# EAGLE board e-book_schema (EAGLE 9.7.0)
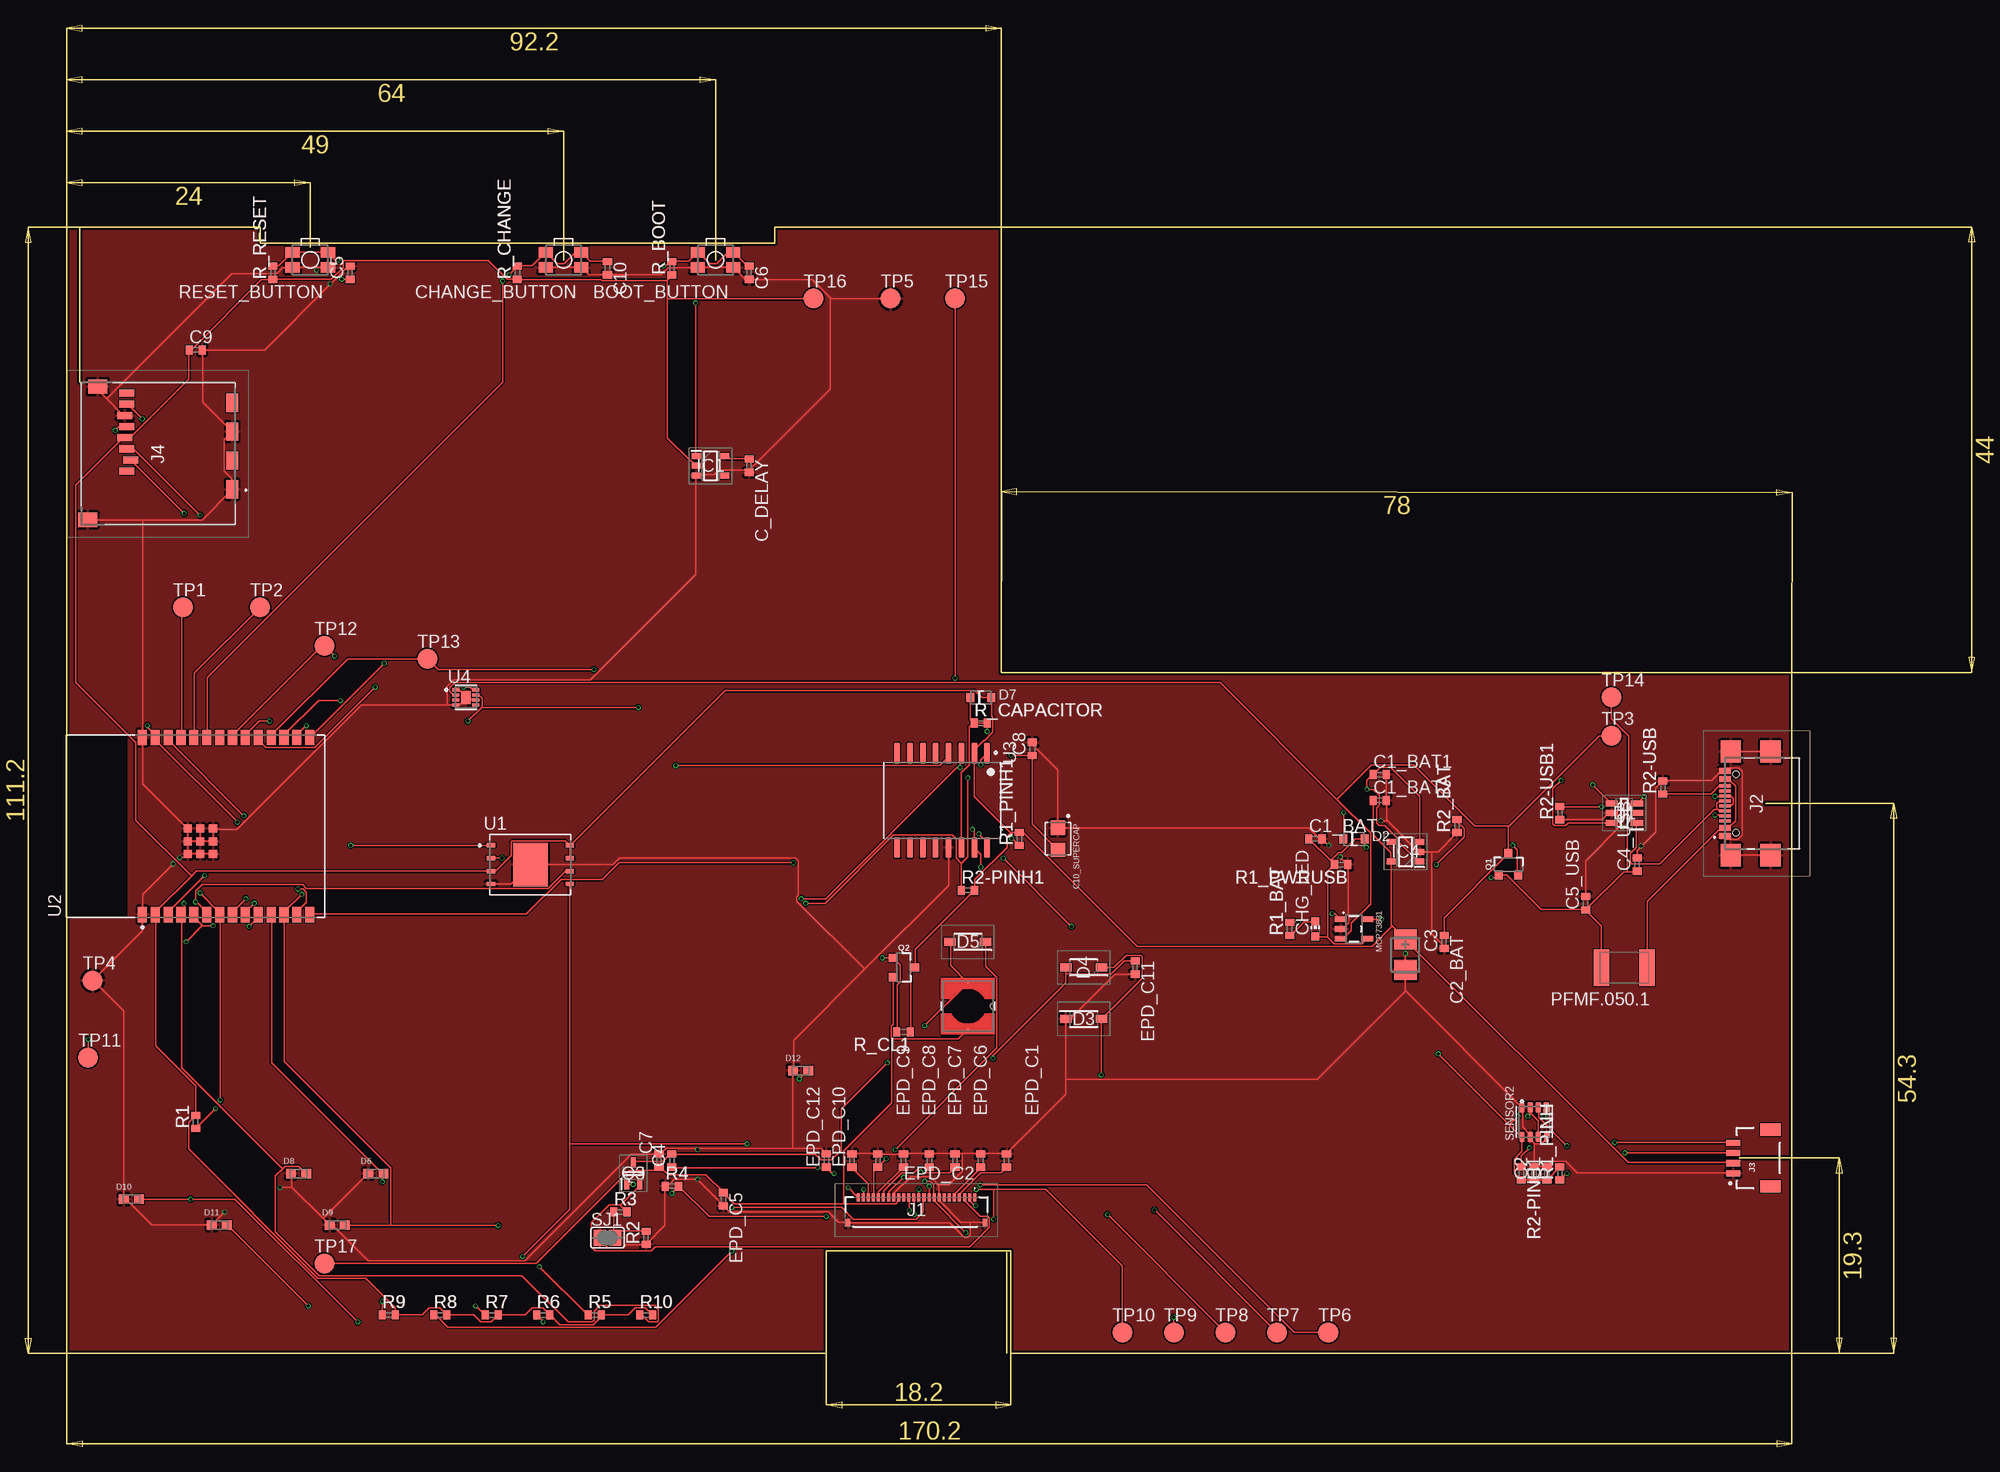
[diagram p1: board, top side]
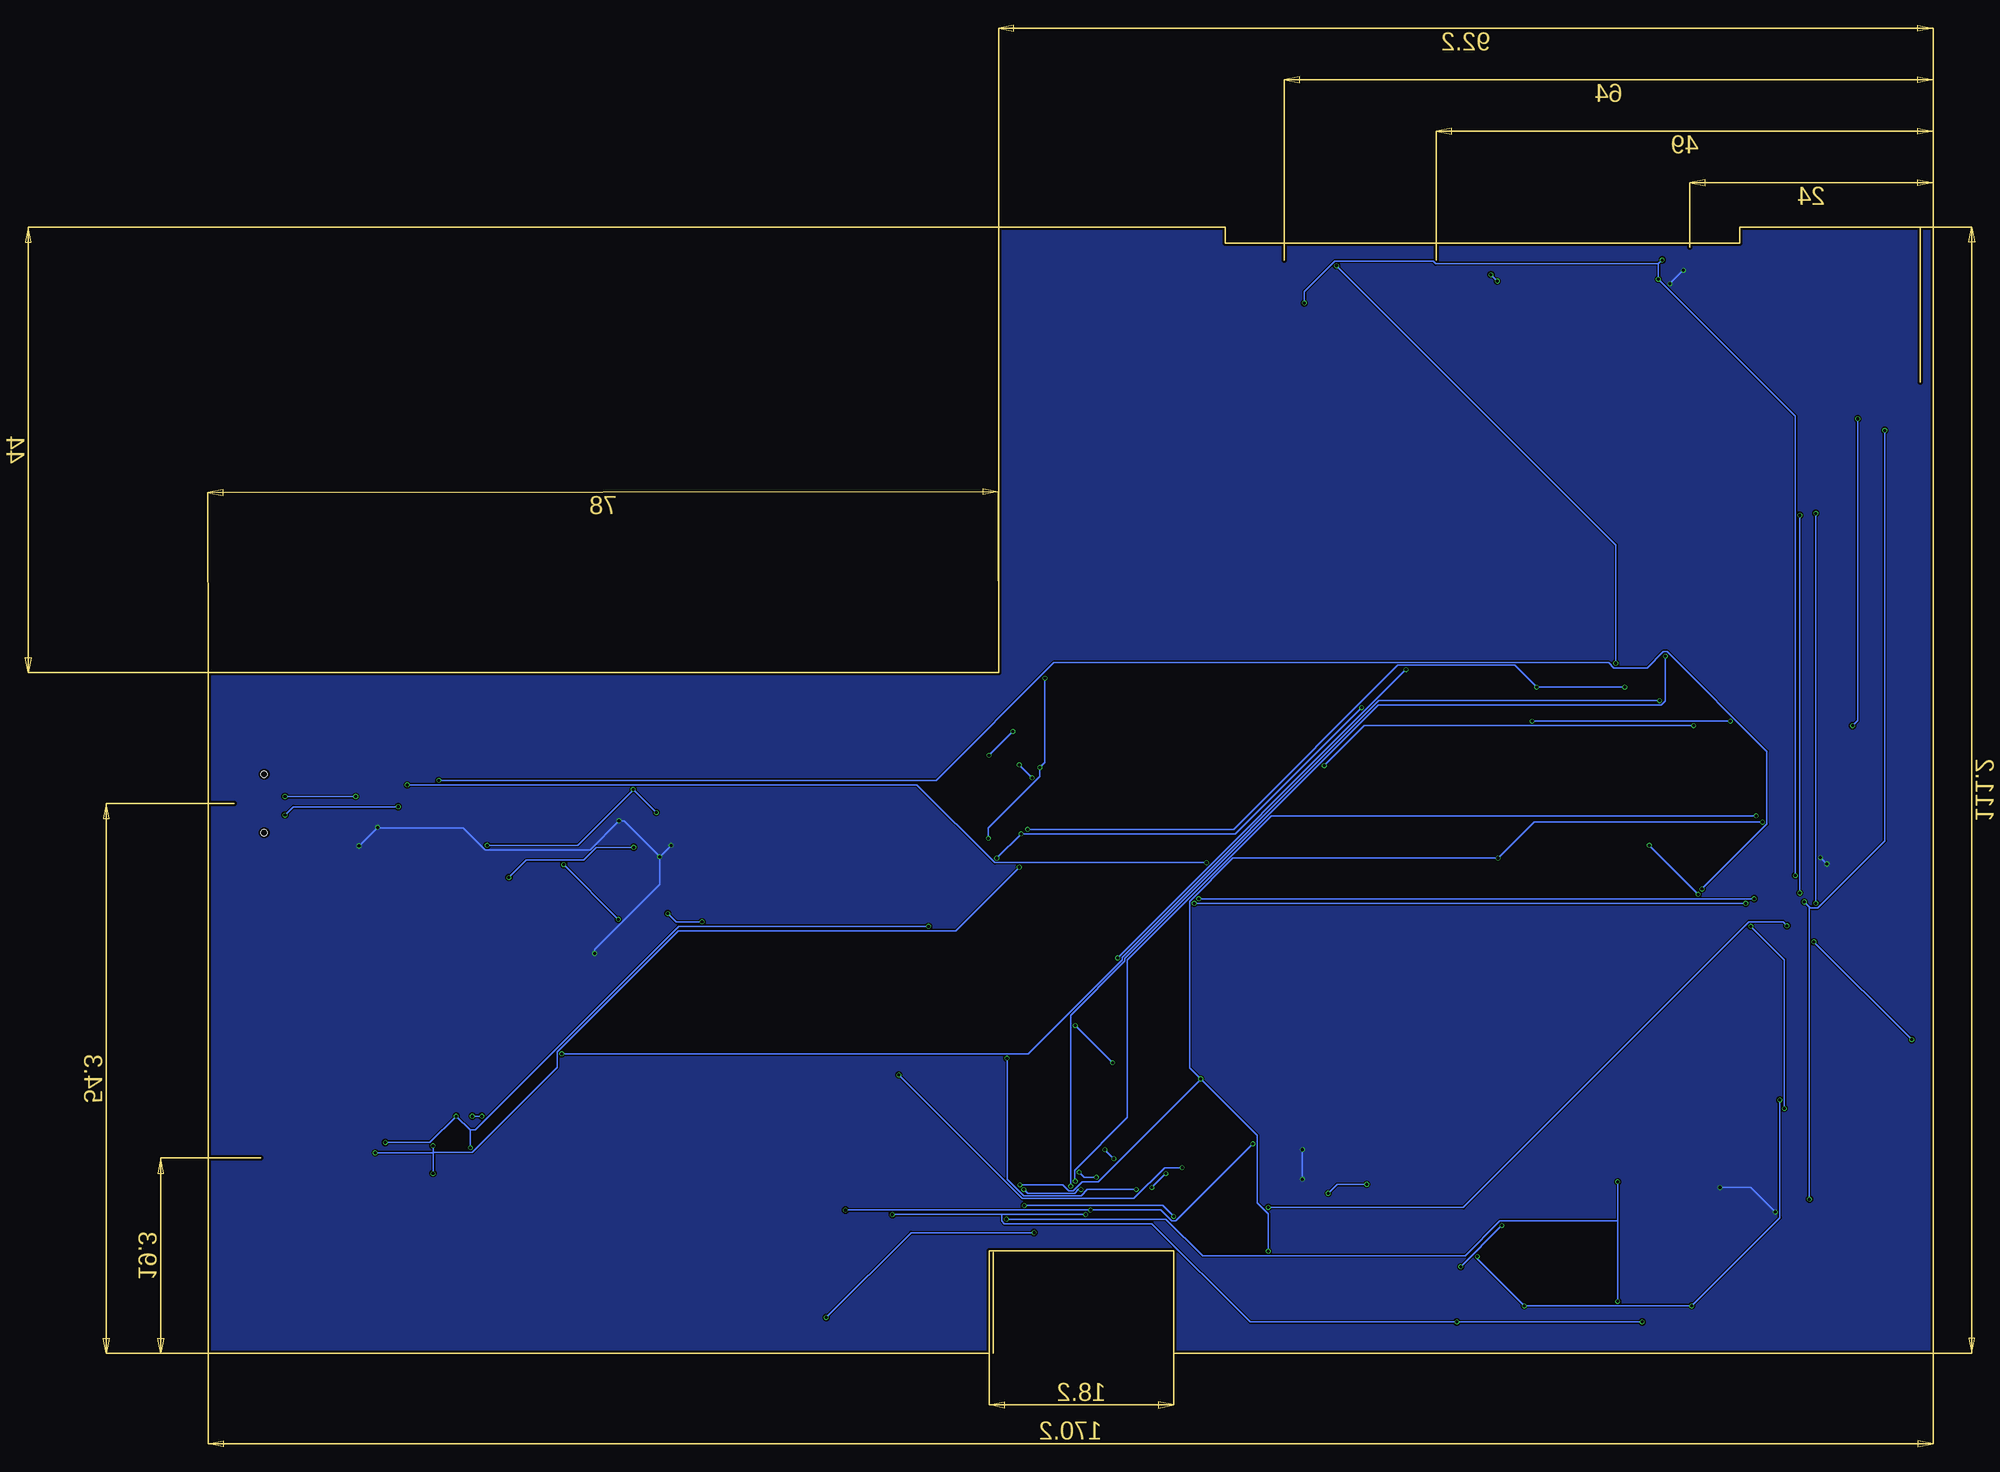
[diagram p2: board, bottom side, seen from below]

Size 170.2 x 111.2 mm. Coordinates in mm from the lower left corner, seen from the top.
Outline: 0,0 0,111.2 19.05,111.2 19.05,109.6 69.85,109.6 69.85,111.2 92.2,111.2 92.2,67.2 170.2,67.2 170.2,0 93.13,0 93.13,10.16 74.93,10.16 74.93,0 0,0
Copper layers (1*16): Top 0.035mm / dielectric 1.6mm / Bottom 0.035mm
Design rules "jlcpcb-2layers.edru": minimum track width 5mil, minimum drill 0.3mm, track to track 5mil, track to pad 5mil, pad to pad 5mil, via to via 5mil, smd to smd 5mil, copper to edge 0.2mm, drill to drill 6mil, minimum pad ring 10mil, minimum via ring 3mil, stop-mask expansion 4mil, vias tented up to drill 0mil, thermal gap 10mil

## Footprints (pad centres in the part's own frame; a part is rotated, then mirrored left to right if it is on the bottom)
MYBUTTON = smd 1.4 x 1.05: 1 1.75,0.75; 2 -1.75,0.75; 3 -1.75,-0.75; 4 1.75,-0.75
EAGLE-LTSPICE_C0402 = smd 0.7 x 0.9: 1 -0.65,0; 2 0.65,0
RCL_CT3528 = smd 2 x 2.2: + -1.5,0; - 1.5,0
CAPCP3225X100N = smd 1.4 x 1.4: 1 -1.1,0; 2 1.1,0
ADAFRUIT_CHIP-LED0603 = smd 0.8 x 0.8: A 0,-0.75; C 0,0.75
SOT95P280X145-6N = smd 1.2 x 0.6: 1 -1.25,0.95; 2 -1.25,0; 3 -1.25,-0.95; 4 1.25,-0.95; 5 1.25,0; 6 1.25,0.95
ESP32_WROVER_AVX---SD0805S020S1R0_AVX_SD0805S020S1R0_0 = smd 0.8 x 0.9: 1 -1.05,0; 2 1.05,0
SOD3716X135N = smd 1.15 x 0.8: 1 -1.75,0; 2 1.75,0
DIOC1608X36N = smd 0.97 x 0.94: 1 -0.75,0; 2 0.75,0
SOT95P280X125-5N = smd 0.9 x 0.6: 1 -1.4,0.95; 2 -1.4,0; 3 -1.4,-0.95; 4 1.4,-0.95; 5 1.4,0.95
SOT95P280X120-5N = smd 0.9 x 0.6: 1 -1.4,0.95; 2 -1.4,0; 3 -1.4,-0.95; 4 1.4,-0.95; 5 1.4,0.95
FH34SRJ24S05SH99 = smd 0.3 x 0.8: 1 5.75,1.45; 2 5.25,1.45; 3 4.75,1.45; 4 4.25,1.45; 5 3.75,1.45; 6 3.25,1.45; 7 2.75,1.45; 8 2.25,1.45; 9 1.75,1.45; 10 1.25,1.45; 11 0.75,1.45; 12 0.25,1.45; 13 -0.25,1.45; 14 -0.75,1.45; 15 -1.25,1.45; 16 -1.75,1.45; 17 -2.25,1.45; 18 -2.75,1.45; 19 -3.25,1.45; 20 -3.75,1.45; 21 -4.25,1.45; 22 -4.75,1.45; 23 -5.25,1.45; 24 -5.75,1.45 | smd 0.4 x 0.8: MP1 6.75,-1.05; MP2 -6.75,-1.05
SAMACSYS_PARTS_USB4110GFA = smd 0.3 x 1.15: A1 -3.35,3.678; A4 -2.55,3.678; A5 -1.25,3.678; A6 -0.25,3.678; A7 0.25,3.678; A8 1.25,3.678; A9 2.55,3.678; A12 3.35,3.678; B1 3.05,3.678; B4 2.25,3.678; B5 1.75,3.678; B6 0.75,3.678; B7 -0.75,3.678; B8 -1.75,3.678; B9 -2.25,3.678; B12 -3.05,3.678 | smd 2.18 x 2: MP1 -5.11,-0.827; MP2 5.11,-0.827; MP3 -5.11,3.103; MP4 5.11,3.103 | hole 0.65: -2.89,2.603; 2.89,2.603
JST04_1MM_RA = smd 0.6 x 1.35: 1 -1.5,0; 2 -0.5,0; 3 0.5,0; 4 1.5,0 | smd 1.2 x 2: NC1 2.8,-3.675; NC2 -2.8,-3.675
112ATAARR03ATTEND = smd 1.8 x 1.2: G1 10.6,10.4; G2 4.9,10.4; S1 7.75,10.4; S2 2.05,10.4 | smd 1.4 x 1.9: G3 13.6,-3.85; G4 0.45,-2.85 | smd 0.7 x 1.5: P1 8.8,0; P2 7.7,0.4; P3 6.6,0; P4 5.5,-0.2; P5 4.4,0; P6 3.3,-0.2; P7 2.2,0; P8 1.1,0
IND_4828-WE-TPC_WRE = smd 0.127 x 0.127: 1 -2.286,0; 2 2.286,0
ESP32_WROVER_SPARKFUN-IC-POWER_SOT23-5 = smd 0.55 x 1.2: 1 -0.95,-1.3; 2 0,-1.3; 3 0.95,-1.3; 4 0.95,1.3; 5 -0.95,1.3
ESP32C6_VARISTOR_CT/CN1812 = smd 1.5 x 3.6: 1 -2.25,0; 2 2.25,0
ESP32_WROVER_SPARKFUN-DISCRETESEMI_SOT23-3 = smd 0.8 x 0.9: 1 -0.95,-1; 2 0.95,-1; 3 0,1.1
SOT65P210X110-3N = smd 1.05 x 0.5: 1 -1.05,0.65; 2 -1.05,-0.65; 3 1.05,0
ESP32_WROVER_EAGLE-LTSPICE_R0402 = smd 0.7 x 0.9: 1 -0.65,0; 2 0.65,0
ESP32_WROVER_BME680_PSON80P300X300X100-8N = smd 1.016 x 0.5: 1 1.458,1.2; 2 1.458,0.4; 3 1.458,-0.4; 4 1.458,-1.2; 5 -1.458,-1.22; 6 -1.458,-0.4; 7 -1.458,0.4; 8 -1.458,1.2
SJ = smd 1.168 x 1.6: 1 -0.762,0; 2 0.762,0
TP20R = smd 2 x 2: TP 0,0
SON127P600X800X80-9N = smd 0.94 x 0.44: 1 -3.895,1.905; 2 -3.895,0.635; 3 -3.895,-0.635; 4 -3.895,-1.905; 5 3.895,-1.905; 6 3.895,-0.635; 7 3.895,0.635; 8 3.895,1.905 | smd 3.4 x 4.3: 9 0,0
XCVR_ESP32-C6-WROOM-1-N8 = smd 1.5 x 0.9: 1 -8.75,5.26; 2 -8.75,3.99; 3 -8.75,2.72; 4 -8.75,1.45; 5 -8.75,0.18; 6 -8.75,-1.09; 7 -8.75,-2.36; 8 -8.75,-3.63; 9 -8.75,-4.9; 10 -8.75,-6.17; 11 -8.75,-7.44; 12 -8.75,-8.71; 13 -8.75,-9.98; 14 -8.75,-11.25; 15 8.75,-11.25; 16 8.75,-9.98; 17 8.75,-8.71; 18 8.75,-7.44; 19 8.75,-6.17; 20 8.75,-4.9; 21 8.75,-3.63; 22 8.75,-2.36; 23 8.75,-1.09; 24 8.75,0.18; 25 8.75,1.45; 26 8.75,2.72; 27 8.75,3.99; 28 8.75,5.26 | smd 0.8 x 0.8: 29_1 -2.755,0.79; 29_2 -1.505,0.79; 29_3 -0.255,0.79; 29_4 -2.755,-0.46; 29_5 -1.505,-0.46; 29_6 -0.255,-0.46; 29_7 -2.755,-1.71; 29_8 -1.505,-1.71; 29_9 -0.255,-1.71
SOIC127P1032X265-16N = smd 2.05 x 0.59: 1 -4.655,4.445; 2 -4.655,3.175; 3 -4.655,1.905; 4 -4.655,0.635; 5 -4.655,-0.635; 6 -4.655,-1.905; 7 -4.655,-3.175; 8 -4.655,-4.445; 9 4.655,-4.445; 10 4.655,-3.175; 11 4.655,-1.905; 12 4.655,-0.635; 13 4.655,0.635; 14 4.655,1.905; 15 4.655,3.175; 16 4.655,4.445
SON50P200X200X80-9N = smd 0.76 x 0.27: 1 -0.985,0.75; 2 -0.985,0.25; 3 -0.985,-0.25; 4 -0.985,-0.75; 5 0.985,-0.75; 6 0.985,-0.25; 7 0.985,0.25; 8 0.985,0.75 | smd 0.9 x 1.3: 9 0,0

## Placement (x,y rotation side)
BOOT_BUTTON  BUTTON_CUSYOMV1  [MYBUTTON]  64,107.95 180 top
C1  100nF  [EAGLE-LTSPICE_C0402]  146.05,17.78 90 top
C1_BAT  4.7uF  [EAGLE-LTSPICE_C0402]  123.19,50.8 0 top
C1_BAT1  4.7uF  [EAGLE-LTSPICE_C0402]  129.54,57.15 0 top
C1_BAT2  4.7uf  [EAGLE-LTSPICE_C0402]  129.54,54.61 0 top
C2  100nF  [EAGLE-LTSPICE_C0402]  144.78,17.78 90 top
C2_BAT  4.7uF  [EAGLE-LTSPICE_C0402]  135.89,40.64 270 top
C3  100uF TANT  [RCL_CT3528]  132.08,39.37 270 top
C4  4.7uF/25V  [EAGLE-LTSPICE_C0402]  59.69,19.05 90 top
C4_USB  100nF  [EAGLE-LTSPICE_C0402]  154.94,48.26 90 top
C5  1uF  [EAGLE-LTSPICE_C0402]  27.94,106.68 90 top
C5_USB  4.7uF  [EAGLE-LTSPICE_C0402]  149.86,44.45 90 top
C6  100nF  [EAGLE-LTSPICE_C0402]  67.31,106.68 270 top
C7  10uF  [EAGLE-LTSPICE_C0402]  58.42,19.05 90 top
C8  100nF  [EAGLE-LTSPICE_C0402]  95.25,59.69 90 top
C9  100nF  [EAGLE-LTSPICE_C0402]  12.7,99.06 0 top
C10  100nF  [EAGLE-LTSPICE_C0402]  53.34,107.13 270 top
C10_SUPERCAP  CPH3225A  [CAPCP3225X100N]  97.79,50.8 270 top
C_DELAY  100nF  [EAGLE-LTSPICE_C0402]  67.31,87.63 270 top
CHANGE_BUTTON  BUTTON_CUSYOMV1  [MYBUTTON]  49,107.95 180 top
CHG_LED  [ADAFRUIT_CHIP-LED0603]  123.19,41.91 0 top
D1  USBLC6-2SC6Y  [SOT95P280X145-6N]  153.67,53.34 180 top
D2  ESP32_WROVER_AVX---SD0805S020S1R0_AVX_SD0805S020S1R0_0_0AVX_SD0805S020S1R0_0_0  [ESP32_WROVER_AVX---SD0805S020S1R0_AVX_SD0805S020S1R0_0]  127,50.8 0 top
D3  MBR0530  [SOD3716X135N]  100.33,33.02 0 top
D4  MBR0530  [SOD3716X135N]  100.33,38.1 180 top
D5  MBR0530  [SOD3716X135N]  88.9,40.64 180 top
D6  PGB1010603MR  [DIOC1608X36N]  30.48,17.78 0 top
D7  ESP32_WROVER_AVX---SD0805S020S1R0_AVX_SD0805S020S1R0_0_0AVX_SD0805S020S1R0_0_0  [ESP32_WROVER_AVX---SD0805S020S1R0_AVX_SD0805S020S1R0_0]  90.17,64.77 0 top
D8  PGB1010603MR  [DIOC1608X36N]  22.86,17.78 0 top
D9  PGB1010603MR  [DIOC1608X36N]  26.67,12.7 0 top
D10  PGB1010603MR  [DIOC1608X36N]  6.35,15.24 0 top
D11  PGB1010603MR  [DIOC1608X36N]  15.03,12.7 0 top
D12  PGB1010603MR  [DIOC1608X36N]  72.39,27.94 0 top
EPD_C1  1uF/50V  [EAGLE-LTSPICE_C0402]  92.71,19.05 90 top
EPD_C2  1uF/50V  [EAGLE-LTSPICE_C0402]  90.17,19.05 90 top
EPD_C5  0.1uF/50V  [EAGLE-LTSPICE_C0402]  64.77,15.24 270 top
EPD_C6  1uF/50V  [EAGLE-LTSPICE_C0402]  87.63,19.05 90 top
EPD_C7  1uF/50V  [EAGLE-LTSPICE_C0402]  85.09,19.05 90 top
EPD_C8  1uF/50V  [EAGLE-LTSPICE_C0402]  82.55,19.05 90 top
EPD_C9  1uF/50V  [EAGLE-LTSPICE_C0402]  80.01,19.05 90 top
EPD_C10  1uF/50V  [EAGLE-LTSPICE_C0402]  77.47,19.05 90 top
EPD_C11  1uF/50V  [EAGLE-LTSPICE_C0402]  105.41,38.1 270 top
EPD_C12  1uF/50V  [EAGLE-LTSPICE_C0402]  74.93,19.05 90 top
IC1  BD5229G-TR  [SOT95P280X125-5N]  63.5,87.63 0 top
IC4  XC6220A331MR-G  [SOT95P280X120-5N]  132.08,49.53 180 top
J1  FH34SRJ-24S-0.5SH_99_  [FH34SRJ24S05SH99]  83.82,13.97 0 top
J2  SAMACSYS_PARTS_USB4110-GF-A  [SAMACSYS_PARTS_USB4110GFA]  167.28,54.3 90 top
J3  QWIIC_RIGHT_ANGLE  [JST04_1MM_RA]  164.43,19.3 90 top
J4  112A-TAAR-R03_ATTEND  [112ATAARR03ATTEND]  5.89,95.9 270 top
L1  68uH  [IND_4828-WE-TPC_WRE]  88.9,34.29 270 top
MCP73831  ESP32_WROVER_SPARKFUN-IC-POWER_MCP73831  [ESP32_WROVER_SPARKFUN-IC-POWER_SOT23-5]  127,41.91 270 top
PFMF.050.1  ESP32C6_VARISTORCN1812  [ESP32C6_VARISTOR_CT/CN1812]  153.67,38.1 180 top
Q1  20V/4.2A/52mΩ/1.4W  [ESP32_WROVER_SPARKFUN-DISCRETESEMI_SOT23-3]  142.24,48.26 0 top
Q2  20V/4.2A/52mΩ/1.4W  [ESP32_WROVER_SPARKFUN-DISCRETESEMI_SOT23-3]  82.55,38.1 270 top
Q3  SI1308EDL-T1-GE3  [SOT65P210X110-3N]  55.88,17.78 90 top
R1  10k  [ESP32_WROVER_EAGLE-LTSPICE_R0402]  12.7,22.86 90 top
R1_BAT  200  [ESP32_WROVER_EAGLE-LTSPICE_R0402]  120.65,41.91 90 top
R1_PINH  10K  [ESP32_WROVER_EAGLE-LTSPICE_R0402]  147.32,17.78 90 top
R1_PINH1  10K  [ESP32_WROVER_EAGLE-LTSPICE_R0402]  93.98,50.8 90 top
R1_PWRUSB  100k  [ESP32_WROVER_EAGLE-LTSPICE_R0402]  125.73,48.26 180 top
R2  2.2  [ESP32_WROVER_EAGLE-LTSPICE_R0402]  57.15,11.43 90 top
R2-PINH  10K  [ESP32_WROVER_EAGLE-LTSPICE_R0402]  143.51,17.78 270 top
R2-PINH1  10K  [ESP32_WROVER_EAGLE-LTSPICE_R0402]  88.9,45.72 0 top
R2-USB  5K1  [ESP32_WROVER_EAGLE-LTSPICE_R0402]  157.48,55.88 90 top
R2-USB1  5K1  [ESP32_WROVER_EAGLE-LTSPICE_R0402]  147.32,53.34 90 top
R2_BAT  2K  [ESP32_WROVER_EAGLE-LTSPICE_R0402]  137.16,52.07 90 top
R3  0.47  [ESP32_WROVER_EAGLE-LTSPICE_R0402]  54.61,13.97 0 top
R4  10k  [ESP32_WROVER_EAGLE-LTSPICE_R0402]  59.69,16.51 0 top
R5  10K  [ESP32_WROVER_EAGLE-LTSPICE_R0402]  52.07,3.81 0 top
R6  10K  [ESP32_WROVER_EAGLE-LTSPICE_R0402]  46.99,3.81 0 top
R7  10K  [ESP32_WROVER_EAGLE-LTSPICE_R0402]  41.91,3.81 0 top
R8  10K  [ESP32_WROVER_EAGLE-LTSPICE_R0402]  36.83,3.81 0 top
R9  10K  [ESP32_WROVER_EAGLE-LTSPICE_R0402]  31.75,3.81 0 top
R10  10K  [ESP32_WROVER_EAGLE-LTSPICE_R0402]  57.15,3.81 0 top
R_BOOT  10K  [ESP32_WROVER_EAGLE-LTSPICE_R0402]  59.69,107.13 90 top
R_CAPACITOR  15  [ESP32_WROVER_EAGLE-LTSPICE_R0402]  90.17,62.23 0 top
R_CHANGE  10K  [ESP32_WROVER_EAGLE-LTSPICE_R0402]  44.45,106.68 90 top
R_CL1  10k  [ESP32_WROVER_EAGLE-LTSPICE_R0402]  82.55,31.75 180 top
R_RESET  10K  [ESP32_WROVER_EAGLE-LTSPICE_R0402]  20.32,106.68 90 top
RESET_BUTTON  BUTTON_CUSYOMV1  [MYBUTTON]  24,107.95 180 top
SENSOR2  ESP32_WROVER_BME680_BME680  [ESP32_WROVER_BME680_PSON80P300X300X100-8N]  144.78,22.86 90 top
SJ1  [SJ]  53.34,11.43 0 top
TP1  TPTP20R  [TP20R]  11.43,73.66 0 top
TP2  TPTP20R  [TP20R]  19.05,73.66 0 top
TP3  TPTP20R  [TP20R]  152.4,60.96 0 top
TP4  TPTP20R  [TP20R]  2.54,36.83 0 top
TP5  TPTP20R  [TP20R]  81.28,104.14 0 top
TP6  TPTP20R  [TP20R]  124.46,2.09 0 top
TP7  TPTP20R  [TP20R]  119.38,2.09 0 top
TP8  TPTP20R  [TP20R]  114.3,2.09 0 top
TP9  TPTP20R  [TP20R]  109.22,2.09 0 top
TP10  TPTP20R  [TP20R]  104.14,2.09 0 top
TP11  TPTP20R  [TP20R]  2.09,29.21 0 top
TP12  TPTP20R  [TP20R]  25.4,69.85 0 top
TP13  TPTP20R  [TP20R]  35.56,68.58 0 top
TP14  TPTP20R  [TP20R]  152.4,64.77 0 top
TP15  TPTP20R  [TP20R]  87.63,104.14 0 top
TP16  TPTP20R  [TP20R]  73.66,104.14 0 top
TP17  TPTP20R  [TP20R]  25.4,8.89 0 top
U1  W25Q512JVEIQ  [SON127P600X800X80-9N]  45.72,48.26 0 top
U2  ESP32-C6-WROOM-1-N8  [XCVR_ESP32-C6-WROOM-1-N8]  12.7,52.07 90 top
U3  DS3231SN#  [SOIC127P1032X265-16N]  86.36,54.61 270 top
U4  MAX17048G+T10  [SON50P200X200X80-9N]  39.37,64.77 0 top

## Tracks (layer width: path | path; a pad name or v marks a point on that pad's centre or on a via)
3V3
  Top 0.127: R_CL1.1 83.25,31.75 83.25,37.72 83.63,38.1 Q2.3 83.69,38.1 83.69,39.88 89.53,45.72 R2-PINH1.2 89.6,45.72 89.6,46.8 92.77,49.97 92.77,51.05 93.12,51.4 | 93.12,51.4 93.15,51.44 93.98,51.44 | 93.12,51.4 89.53,54.99 U3.2 89.53,59.56 90.49,60.52 90.55,60.52 91.38,61.34 91.38,62.8 91.25,62.93 91.25,64.77 D7.2 90.3,64.77 89.6,65.47 64.96,65.47 49.66,50.16 U1.8 49.59,50.16 | C1_BAT2.1 128.91,54.61 128.91,51.18 130.62,49.47 130.62,48.64 IC4.5 130.68,42.29 130.78,42.2 | J3.2 164.4,18.86 154.05,18.86 132.08,40.83 C3.+ 132.08,40.89 130.78,42.2 | 93.98,51.44 94.36,51.44 105.6,40.2 128.78,40.2 130.78,42.2 | 93.98,51.44 R1_PINH1.2 | 59.21,105.95 59.69,106.43 R_BOOT.1 | 59.21,105.95 59.18,105.92 52.77,105.92 52.7,105.98 44.45,105.98 R_CHANGE.1 44.45,106.05 43.43,106.05 41.59,107.89 27.37,107.89 27.24,107.76 27.24,107.19 26.1,106.05 20.32,106.05 R_RESET.1 20.32,105.98 19.18,105.98 12.26,99.06 C9.1 12,99.06 12,96.2 6.22,90.42 5.71,90.42 J4.P4 5.65,90.36 5.52,90.36 0.89,85.72 0.89,66.23 6.79,60.33 6.79,52.64 12.29,47.15 | 59.24,104.14 59.24,105.92 59.21,105.95 | 59.24,104.14 59.24,90.36 61.53,88.08 61.59,88.08 62.04,87.63 IC1.2 | 59.24,104.14 TP16.TP | R10.2 57.78,3.81 57.09,4.51 56.07,4.51 55.37,3.81 R5.2 52.7,3.81 52.7,3.62 51.94,2.86 48.64,2.86 47.69,3.81 R6.2 47.62,3.81 46.93,4.51 45.91,4.51 45.21,3.81 R7.2 42.55,3.81 41.85,3.11 40.83,3.11 40.13,3.81 R8.2 37.47,3.81 36.77,4.51 35.75,4.51 35.05,3.81 R9.2 32.38,3.81 32.38,4.51 29.46,7.43 24.77,7.43 12,20.19 12,22.8 12.7,23.5 R1.2 12.7,26.42 8.76,30.35 8.76,43.31 U2.2 8.76,43.37 8.76,43.62 12.29,47.15
  Top 0.127: 49.59,50.16 49.15,50.61 43.94,50.61 43.81,50.48 43.81,49.15 42.29,47.62 U1.3 12.76,47.62 12.29,47.15 | 49.59,50.16 49.59,48.9 U1.7
32KHZ  (via drill 0.3)
  Top 0.127: 88.27,48.39 88.27,45.72 R2-PINH1.1 | 88.27,48.39 88.9,49.02 v88.9,56.83 | v90.17,58.1 90.17,58.61 90.81,59.24 U3.1 | v18.48,44.45 17.65,43.62 17.65,43.37 U2.9 | v72.9,44.45 74.8,44.45 81.53,51.18 87.38,51.18 87.76,50.8 87.76,48.9 88.27,48.39
  Bottom 0.127: v90.17,58.1 v88.9,56.83 | v72.9,44.45 v18.48,44.45
DN
  Top 0.127: 162.85,53.75 162.81,53.78 162.81,54.29 163.07,54.55 163.58,54.55 J2.A7 | 162.85,53.75 163,53.59 163.58,53.59 J2.B7 | D1.1 154.88,52.39 154.88,49.97 154.24,49.34 154.24,48.51 154.43,48.32 157.16,48.32 162.56,53.72 162.81,53.72 162.85,53.75
DP  (via drill 0.3)
  Top 0.127: J2.A6 163.64,54.1 164.21,54.1 164.4,54.29 164.4,54.8 164.21,54.99 163.64,54.99 J2.B6 163.58,54.99 v162.62,54.99 | v155.64,54.99 154.94,54.29 D1.3
  Bottom 0.127: v162.62,54.99 v155.64,54.99
EPD_3V3
  Top 0.127: 81.44,31.08 81.47,31.05 87.95,31.05 L1.2 | 81.44,31.08 81.34,31.18 81.34,32.32 81.53,32.51 81.53,37.15 Q2.2 | J1.15 82.55,15.43 82.11,15.43 J1.16 82.04,15.37 82.04,15.05 81.79,14.8 76.64,14.8 | 58.42,18.35 58.61,18.35 59.31,17.65 63.06,17.65 64.77,15.94 EPD_C5.1 64.77,15.88 65.85,14.8 76.64,14.8 | TP17.TP 46.29,8.89 55.5,18.1 58.17,18.1 58.42,18.35 | 58.42,18.35 C7.1 | 76.64,14.8 76.64,20 81.41,24.77 81.41,31.05 81.44,31.08
EPD_3V3_C  (via drill 0.3)
  Top 0.127: R_CL1.2 81.92,31.75 81.92,36.39 82.23,36.7 82.23,38.35 81.6,38.99 Q2.1 81.53,39.05 v80.45,39.05 | U2.18 20.19,60.83 20.19,61.09 27.69,68.58 TP13.TP 36.64,67.5 v52.01,67.5
  Bottom 0.127: v52.01,67.5 v80.45,39.05
EPD_BUSY  (via drill 0.3)
  Top 0.127: v88.71,11.94 85.6,15.05 85.6,15.37 J1.9 85.53,15.43 85.53,16.7 85.22,17.02 v84.64,17.02 | TP9.TP v109.22,3.56 | v17.46,53.09 10.03,60.52 10.03,60.77 U2.26
  Bottom 0.127: v88.71,11.94 100.84,11.94 v109.22,3.56 | v17.46,53.09 65.28,53.09 79.5,38.86 79.5,23.3 84.71,18.1 84.71,17.08 v84.64,17.02
EPD_CS  (via drill 0.3)
  Top 0.127: v84.07,16.19 J1.12 | 91.44,16.19 96.58,16.19 104.14,8.64 TP10.TP | 91.44,16.19 v89.72,16.19 | v31.11,5.14 31.11,3.81 R9.1 | v31.11,16.95 31.11,17.72 31.18,17.78 D6.2 31.11,17.78 20.19,28.7 20.19,43.31 U2.11 | v91.44,13.27 91.44,16.19
  Bottom 0.127: v84.07,16.19 84.33,16.19 84.71,15.81 89.34,15.81 v89.72,16.19 | v31.11,16.95 31.11,13.08 | 31.11,13.08 v31.11,5.14 | v91.44,13.27 75.69,13.27 72.07,9.65 46.16,9.65 42.74,13.08 31.11,13.08
EPD_DC  (via drill 0.3)
  Top 0.127: v65.6,14.41 76.45,14.41 77.6,13.27 83.82,13.27 84.52,13.97 84.52,15.37 J1.11 | v14.41,42.23 13.4,42.23 13.37,42.26 | 13.37,42.26 12.57,43.05 12.57,43.31 U2.5 | v2.1,30.99 TP11.TP | 13.37,42.26 v11.75,40.64
  Bottom 0.127: v65.6,14.41 46.35,14.41 18.16,42.61 14.8,42.61 v14.41,42.23 | v11.75,40.64 v2.1,30.99
EPD_RST  (via drill 0.3)
  Top 0.127: v85.09,16.51 85.09,15.43 J1.10 | v26.42,68.83 TP12.TP 25.4,69.79 25.08,69.79 16.38,61.09 16.38,60.83 U2.21
  Bottom 0.127: v85.09,16.51 85.09,33.4 79.76,38.73 79.76,38.99 54.74,64.01 26.8,64.01 26.42,64.39 v26.42,68.83
FLASH_CS  (via drill 0.3)
  Top 0.127: v28,50.16 U1.1 | v23.18,45.34 21.46,43.62 21.46,43.37 U2.12 21.46,43.31 21.46,28.83 31.94,18.35 31.94,12.64 | v46.61,8.57 51.37,3.81 R5.1 | 31.94,12.64 27.5,12.64 27.43,12.7 D9.2 | 31.94,12.64 v42.55,12.64
  Bottom 0.127: v23.18,45.34 v28,50.16 | v42.55,12.64 v46.61,8.57
GDR  (via drill 0.3)
  Top 0.127: v89.66,14.61 89.53,14.61 89.09,15.05 89.09,15.37 J1.2 | v74.93,13.53 63.37,13.53 60.39,16.51 | v55.88,16.7 55.24,16.7 Q3.1 | 60.39,16.51 v59.69,15.81 | 60.39,16.51 R4.2
  Bottom 0.127: v89.66,14.61 76.01,14.61 v74.93,13.53 | v55.88,16.7 58.8,16.7 v59.69,15.81
GND  (via drill 0.3)
  Top 0.127: 25.27,13.34 25.91,12.7 D9.1 26.16,12.7 29.72,9.14 45.15,9.14 55.69,19.68 58.42,19.68 C7.2 58.42,19.75 58.61,19.75 59.12,20.26 62.23,20.26 | 25.27,13.34 22.19,16.41 | 22.19,16.41 22.16,16.45 22.16,17.78 D8.1 | 25.27,13.34 29.72,17.78 D6.1 | v21.02,16.38 22.16,16.38 22.19,16.41 | v15.56,13.97 D11.1 8.38,12.7 5.84,15.24 D10.1 5.59,15.24 5.59,33.85 2.6,36.83 TP4.TP 7.43,41.72 7.43,43.31 U2.1 7.49,43.37 7.49,45.34 v10.48,48.32 | C10.2 51.5,106.49 50.8,107.19 CHANGE_BUTTON.2 50.74,107.25 47.31,107.25 CHANGE_BUTTON.1 | TP5.TP 75.37,104.14 75.34,104.17 | 75.34,104.17 73.53,105.98 67.31,105.98 C6.2 67.31,106.05 66.93,106.05 65.79,107.19 BOOT_BUTTON.2 65.72,107.25 62.29,107.25 BOOT_BUTTON.1 62.23,107.19 59.31,107.19 58.61,106.49 C10.2 | 75.34,104.17 75.31,104.14 75.31,95.19 67.25,87.12 C_DELAY.2 67.31,87 67.12,87.19 64.33,87.19 63.88,86.74 62.1,86.74 IC1.3 62.04,86.68 62.04,76.9 51.63,66.48 38.16,66.48 37.53,65.85 37.53,64.01 | C10.2 | U4.9 39.37,64.71 38.73,64.07 38.42,64.07 U4.4 38.35,64.01 37.53,64.01 | U4.9 39.37,64.83 38.73,65.47 38.42,65.47 U4.1 | U4.6 40.32,64.58 39.31,64.58 U4.9 | U2.29_1 11.94,49.34 11.94,50.55 U2.29_2 | U2.29_2 11.94,50.61 11.94,51.75 U2.29_3 11.87,51.82 7.49,56.2 7.49,60.77 U2.28 7.49,60.83 7.49,82.3 | U2.29_1 12,49.34 13.14,49.34 U2.29_4 13.21,49.34 14.35,49.34 U2.29_7 | U2.29_5 13.14,50.61 12,50.61 U2.29_2 | U2.29_6 13.14,51.75 13.14,50.67 U2.29_5 | U2.29_5 13.21,50.61 14.35,50.61 U2.29_8 14.41,50.61 14.41,51.75 U2.29_9 14.48,51.75 16.76,51.75 29.02,64.01 37.53,64.01 | 24.64,107.25 25.72,107.25 RESET_BUTTON.2 | 24.64,107.25 22.29,107.25 RESET_BUTTON.1 22.23,107.19 21.27,107.19 20.7,106.62 16.26,106.62 3.9,94.27
  Top 0.127: 3.9,94.27 3.05,95.12 J4.G4 | 3.9,94.27 5.52,92.65 5.65,92.65 J4.P6 | 13.4,99.06 13.4,93.92 16.26,91.06 J4.G2 16.26,91 15.49,90.23 15.49,87.12 16.26,86.36 16.26,85.34 J4.G1 16.32,85.28 13.34,82.3 7.49,82.3 | 26,105.57 19.49,99.06 13.4,99.06 | 26,105.57 27.75,107.31 27.94,107.31 C5.2 | 13.4,99.06 C9.2 | 7.49,82.3 2.1,82.3 J4.G3 | v24.64,106.93 24.64,107.25 | v25.97,105.6 26,105.57 | v11.11,48.96 11.56,48.96 11.87,49.28 U2.29_1 | U1.4 43.81,46.35 U1.9 53.91,48.26 54.55,48.9 71.88,48.9 72.14,48.64 72.14,45.21 72.01,45.09 72.01,44.64 78.71,37.94 | 71.63,20.26 74.42,20.26 74.93,19.75 EPD_C12.2 | 71.63,20.26 62.23,20.26 | 71.63,20.26 71.63,27.94 D12.1 71.69,27.94 71.69,30.92 78.71,37.94 | U3.13 87,46.23 78.71,37.94 | SJ1.1 52.58,11.24 53.4,10.41 54.8,10.41 55.12,10.73 57.15,10.73 R2.1 57.15,10.79 58.99,12.64 58.99,16.51 R4.1 59.24,16.51 59.94,17.21 62.17,17.21 62.2,17.18 | 62.2,17.18 64.77,14.61 EPD_C5.2 64.77,14.54 65.34,13.97 75.12,13.97 76.14,12.95 77.03,12.95 J1.MP2 77.09,12.89 87.12,12.89 88.52,11.49 88.9,11.49 89.15,11.75 89.15,12.95 | 86.01,16.61 86.04,16.57 86.04,15.43 J1.8 86.11,15.37 86.11,15.05 88.2,12.95 89.15,12.95 | 86.01,16.61 85.15,17.46 83.25,17.46 81.6,15.81 81.6,15.43 J1.17 | 89.15,12.95 90.55,12.95 J1.MP1 | EPD_C11.2 105.41,37.4 103.38,37.4 99,33.02 D3.1 98.55,33.02 98.55,27.05 | EPD_C10.2 77.47,19.75 80.01,19.75 EPD_C9.2 80.01,19.68 82.55,19.68 EPD_C8.2 82.55,19.75 85.09,19.75 | 85.09,19.75 87.63,19.75 | 85.09,19.75 EPD_C7.2 | 87.63,19.75 88.33,19.75 | 88.33,19.75 90.17,19.75 | 87.63,19.75 EPD_C6.2 | 90.17,19.75 92.71,19.75 | 90.17,19.75 EPD_C2.2
  Top 0.127: 98.55,27.05 98.55,25.59 92.71,19.75 | 92.71,19.75 EPD_C1.2 | 88.33,19.75 88.33,17.97 87,16.64 86.04,16.64 86.01,16.61 | v62.23,20.13 62.23,20.26 | v62.23,17.21 62.2,17.18 | 146.05,18.48 144.78,18.48 | 144.81,20.73 144.84,20.7 145.48,20.7 145.99,21.21 145.99,21.4 SENSOR2.5 | 144.81,20.73 144.4,21.14 144.4,21.4 SENSOR2.7 144.34,21.46 144.34,21.65 143.64,22.35 143.64,24.26 SENSOR2.1 132.11,35.78 | 144.78,18.48 144.78,20.7 144.81,20.73 | 144.78,18.48 C2.2 | 146.05,18.48 146.56,18.99 147.89,18.99 149.03,17.84 164.4,17.84 J3.1 | 146.05,18.48 C1.2 | 132.11,35.78 132.08,35.81 C3.- v132.08,39.5 | C5_USB.2 149.86,48.64 153.19,51.98 | 153.19,51.98 153.23,52.01 153.23,52.77 152.65,53.34 D1.5 152.15,53.34 151.51,52.7 147.32,52.7 R2-USB1.1 | C4_USB.2 154.94,49.66 155.35,50.07 | 155.35,50.07 156.78,51.5 156.78,55.82 157.48,56.52 R2-USB.2 157.48,56.58 162.31,56.58 163.07,57.34 163.58,57.34 J2.B1 163.64,57.4 163.64,57.59 J2.A12 | J2.B12 163.64,51.24 163.64,50.99 J2.A1 163.64,50.93 163.64,50.74 | 163.64,50.74 163.64,49.72 164.15,49.21 J2.MP3 164.21,49.21 168.08,49.21 J2.MP1 | 163.64,57.78 163.64,58.86 164.15,59.37 J2.MP4 164.21,59.44 168.08,59.44 J2.MP2 | 163.64,57.78 163.64,57.66 J2.A12 | 163.64,50.74 164.85,50.74 165.29,51.18 165.29,57.47 164.97,57.78 163.64,57.78 | 163.64,57.78 J2.A12 | v153.48,51.94 153.23,51.94 153.19,51.98 | v155.32,50.1 155.35,50.07 | C1_BAT1.2 130.18,57.15 130.18,54.61 C1_BAT2.2 130.24,54.61 130.24,52.64 130.27,52.61 | 134.68,49.53 135.32,49.53 137.16,51.37 R2_BAT.1 | 134.68,49.53 IC4.2 133.35,49.53 130.27,52.61 | C2_BAT.2 135.89,40.2 134.68,41.4 134.68,49.53
  Top 0.127: MCP73831.2 125.92,41.91 126.49,42.48 126.49,43.24 126.43,43.31 126.43,48.26 R1_PWRUSB.1 126.36,48.26 125.67,48.96 v125.67,49.02 | C8.2 95.25,60.13 97.79,57.59 C10_SUPERCAP.1 97.79,51.88 122.56,51.88 123.64,50.8 C1_BAT.2 123.89,50.8 v124.52,50.16 | v129.67,52.58 130.24,52.58 130.27,52.61 | 98.55,27.05 123.38,27.05 132.11,35.78
  Bottom 0.127: v21.02,16.38 17.97,16.38 v15.56,13.97 | v25.97,105.6 v24.64,106.93 | v11.11,48.96 v10.48,48.32 | v62.23,17.21 v62.23,20.13 | v155.32,50.1 v153.48,51.94 153.48,51.88 145.03,51.88 142.88,49.72 132.52,49.72 v129.67,52.58 129.16,52.58 125.67,49.09 v125.67,49.02 | v124.52,50.16 v125.67,49.02 | v132.08,39.5 132.08,39.88 125.67,46.29 v125.67,49.02
  pour Top: 0.08,0.08 170.1,0.08 170.1,67.28 125.7,111.68 0.08,111.68
  pour Bottom: 170.1,0.08 170.1,67.23 137.14,67.23 137.12,67.25 92.68,111.68 0.08,111.68 0.08,0.08
GPIO8  (via drill 0.3)
  Top 0.127: v14.67,24.19 12.7,22.23 R1.1 | v17.97,42.16 18.86,43.05 18.86,43.31 U2.10
  Bottom 0.127: v14.67,24.19 14.67,38.86 v17.97,42.16
I2C_PW  (via drill 0.3)
  Top 0.127: 144.43,23.72 144.4,23.75 144.4,24.26 SENSOR2.2 | 144.43,23.72 145.16,22.99 145.16,21.46 SENSOR2.6 | 144.78,17.14 143.51,17.14 | 144.78,17.14 146.05,17.14 | 144.78,17.14 C2.1 | 146.05,17.14 147.32,18.41 R1_PINH.2 | 146.05,17.14 C1.1 | 143.51,17.14 142.81,17.84 142.81,19.18 143.57,19.94 SENSOR2.8 143.51,21.4 142.34,22.57 | 143.51,17.14 R2-PINH.2 | v26.99,64.45 24.83,64.45 21.46,61.09 21.46,60.83 U2.17 | 142.34,22.57 v135.32,29.59 | v144.15,23.43 144.43,23.72 | 142.34,22.57 v143.19,23.43
  Bottom 0.127: v26.99,64.45 54.67,64.45 80.01,39.12 80.01,38.86 89.28,29.59 v135.32,29.59 | v143.19,23.43 v144.15,23.43
INT_RTC  (via drill 0.3)
  Top 0.127: v93.22,50.86 93.28,50.86 93.98,50.16 R1_PINH1.1 | U3.3 88.27,59.24 88.14,59.12 v88.14,57.85 87.82,57.85 74.87,44.9 v72.45,44.9 | v17.65,44.9 16.38,43.62 16.38,43.37 U2.8 | v87.63,66.67 TP15.TP
  Bottom 0.127: v93.22,50.86 93.22,51.88 88.14,56.96 v88.14,57.85 87.63,58.36 v87.63,66.67 | v72.45,44.9 v17.65,44.9
IO/BOOT  (via drill 0.3)
  Top 0.127: C6.1 67.31,107.38 67.12,107.38 65.79,108.71 BOOT_BUTTON.3 65.72,108.65 65.22,108.65 64.14,107.57 63.44,107.57 62.29,108.71 BOOT_BUTTON.4 62.23,108.71 61.34,107.82 59.69,107.82 R_BOOT.2 59.69,107.76 59.5,107.76 59.12,107.38 v58.86,107.38 | v31.3,68.14 24,60.83 U2.15
  Bottom 0.127: v31.3,68.14 31.3,79.82 v58.86,107.38
IO/CHANGE  (via drill 0.3)
  Top 0.127: C10.1 53.34,107.82 51.63,107.82 50.8,108.65 CHANGE_BUTTON.3 50.74,108.65 50.16,108.65 49.09,107.57 48.39,107.57 47.31,108.65 CHANGE_BUTTON.4 47.24,108.71 45.91,107.38 44.45,107.38 R_CHANGE.2 44.45,107.31 v43.62,106.49 | v42.99,105.86 42.99,95.89 13.84,66.74 13.84,60.83 U2.23
  Bottom 0.127: v43.62,106.49 v42.99,105.86
MISO  (via drill 0.3)
  Top 0.127: R8.1 36.39,3.81 37.59,2.6 58.1,2.6 v65.6,10.1 | v72.26,27.11 73.09,27.94 D12.2 | v42.93,48.9 U1.2 | v16.83,52.45 8.76,60.52 8.76,60.77 U2.27 8.7,60.83 8.7,61.09 7.94,61.85 v7.94,61.98 | v7.43,92.27 6.03,93.66 5.91,93.66 J4.P7 | v90.11,16.64 106.55,16.64 121.09,2.1 TP6.TP
  Bottom 0.127: v65.6,10.1 65.6,13.78 66.67,14.86 66.67,21.53 v72.26,27.11 | v72.26,27.11 73.34,28.19 73.34,44.64 69.09,48.9 v42.93,48.9 39.37,52.45 v16.83,52.45 | v7.43,92.27 7.43,62.48 v7.94,61.98 | v90.11,16.64 85.85,16.64 85.28,16.07 84.84,16.07 83.95,16.95 82.36,16.95 72.26,27.05 v72.26,27.11
MOSI  (via drill 0.3)
  Top 0.127: v83.12,14.16 83.12,15.37 J1.14 | v107.31,14.16 TP7.TP | v40.32,4.7 41.21,3.81 R7.1 | v23.81,4.7 15.81,12.7 D11.2 | 49.59,20.7 49.59,14.22 v44.96,9.59 | 49.59,20.7 49.59,46.35 U1.5 | v15.11,25.02 15.11,43.31 U2.7 15.05,43.37 15.05,43.56 v13.14,45.47 | v13.14,82.74 6.6,89.28 5.91,89.28 J4.P3 | 49.59,20.7 v67.12,20.7
  Bottom 0.127: v107.31,14.16 v83.12,14.16 76.2,14.16 75.12,13.08 74.74,13.08 v67.12,20.7 | v44.96,9.59 44.96,9.34 v40.32,4.7 v23.81,4.7 15.11,13.4 v15.11,25.02 | v13.14,45.47 v13.14,82.74
N$1  (via drill 0.3)
  Top 0.127: v151.45,53.98 147.32,53.98 R2-USB1.2 | v162.62,53.15 163.51,53.15 163.58,53.09 J2.A5
  Bottom 0.127: v151.45,53.98 161.8,53.98 v162.62,53.15
N$2
  Top 0.127: R2-USB.1 157.48,55.24 162.24,55.24 163,56.01 163.58,56.01 J2.B5
N$3  (via drill 0.3)
  Top 0.127: v125.98,53.4 125.98,50.8 D2.1 | IC4.1 133.48,48.64 133.29,48.64 131.38,50.55 131.38,50.8 130.05,52.13 129.48,52.13 129.22,52.39 129.22,53.85 129.48,54.1 129.48,55.12 128.91,55.69 v128.27,55.69 128.27,56.58 128.84,57.15 C1_BAT1.1 128.91,57.15 129.6,57.85 130.62,57.85 133.48,54.99 IC4.3 | v142.69,50.16 143.13,49.72 143.13,47.31 Q1.2
  Bottom 0.127: v125.98,53.4 v128.27,55.69 128.27,55.63 133.73,50.16 v142.69,50.16
N$5  (via drill 0.3)
  Top 0.127: v77.09,16.38 78.04,15.43 J1.24 | v75.69,17.78 75.5,17.78 74.93,18.35 EPD_C12.1
  Bottom 0.127: v75.69,17.78 v77.09,16.38
N$6  (via drill 0.3)
  Top 0.127: v74.11,18.35 59.69,18.35 C4.1 | v102.04,27.5 102.04,33.02 D3.2 102.11,33.02 106.11,37.02 106.11,39.18 105.98,39.31 104.52,39.31 103.31,38.1 D4.1
  Bottom 0.127: v74.11,18.35 75.82,18.35 78.87,15.3 89.85,15.3 v102.04,27.5
N$7
  Top 0.127: CHG_LED.C 123.19,42.61 122.11,42.61 120.78,41.27 120.65,41.27 R1_BAT.1
N$8  (via drill 0.3)
  Top 0.127: v121.47,42.61 120.65,42.61 R1_BAT.2 | v124.84,43.43 125.09,43.43 125.67,42.86 MCP73831.1
  Bottom 0.127: v121.47,42.61 124.02,42.61 v124.84,43.43
N$9  (via drill 0.3)
  Top 0.127: R2_BAT.2 137.16,52.51 137.86,51.82 137.86,50.99 v135.13,48.26 | v129.73,42.86 128.33,42.86 MCP73831.5
  Bottom 0.127: v129.73,42.86 v135.13,48.26
N$10
  Top 0.127: C_DELAY.1 67.31,88.33 65.15,88.33 64.96,88.52 IC1.5
N$11
  Top 0.127: J1.22 79.06,15.43 79.06,16.76 77.47,18.35 EPD_C10.1
N$13
  Top 0.127: J1.20 80.07,15.94 82.55,18.41 EPD_C8.1
N$14
  Top 0.127: J1.19 80.58,15.43 80.58,16.07 82.36,17.84 83.57,17.84 84.07,18.35 85.09,18.35 EPD_C7.1
N$15  (via drill 0.3)
  Top 0.127: v82.55,17.4 81.09,15.94 81.09,15.43 J1.18 | v84.26,17.91 84.45,17.91 84.52,17.84 87.12,17.84 87.63,18.35 EPD_C6.1
  Bottom 0.127: v82.55,17.4 83.76,17.4 v84.26,17.91
N$17
  Top 0.127: J1.5 87.63,15.43 87.63,15.81 90.17,18.35 EPD_C2.1
N$18
  Top 0.127: J1.4 88.08,15.75 90.17,17.84 92.2,17.84 92.71,18.35 EPD_C1.1
PREVGH  (via drill 0.3)
  Top 0.127: J1.21 79.63,15.43 79.63,17.97 80.01,18.35 EPD_C9.1 80.01,18.41 v80.83,19.24 | v81.72,20.13 91.76,30.16 91.76,37.15 90.68,38.23 90.68,40.64 D5.1
  Bottom 0.127: v80.83,19.24 v81.72,20.13
PREVGL  (via drill 0.3)
  Top 0.127: v78.61,16.19 78.61,15.43 J1.23 | v91.38,29.15 91.38,29.4 98.55,36.58 98.55,37.47 | 98.55,37.47 98.55,38.1 D4.2 | 98.55,37.47 103.06,37.47 104.33,38.73 105.41,38.73 EPD_C11.1
  Bottom 0.127: v78.61,16.19 83.44,16.19 84.07,15.56 89.72,15.56 91.38,17.21 v91.38,29.15
RESE
  Top 0.127: 54.58,14.64 55.24,13.97 R3.2 | 54.58,14.64 54.55,14.67 53.53,14.67 51.75,12.89 51.75,10.54 52.13,10.16 57.66,10.16 58.04,10.54 89.09,10.54 91,12.45 91,13.4 90.87,13.53 90.11,13.53 88.58,15.05 88.58,15.37 J1.3 | 54.58,14.64 56.52,16.57 56.52,16.7 Q3.2
RESE'
  Top 0.127: 53.98,12.13 53.98,11.56 SJ1.2 53.98,12.13 | 53.98,12.13 53.98,13.97 R3.1 | 53.98,12.13 57.15,12.13 R2.2
RESET  (via drill 0.3)
  Top 0.127: R_RESET.2 20.32,107.38 20.89,107.38 22.23,108.71 RESET_BUTTON.4 22.29,108.71 25.72,108.71 RESET_BUTTON.3 25.78,108.65 26.48,107.95 v26.73,107.95 | v27.11,106.05 27.94,106.05 C5.1 | v62.04,103.69 62.04,88.58 IC1.1 | v13.59,47.18 10.03,43.62 10.03,43.37 U2.3
  Bottom 0.127: 27.11,107.57 v27.11,106.05 13.59,92.52 v13.59,47.18 | v26.73,107.95 27.11,107.57 | v62.04,103.69 62.04,104.84 59.05,107.82 49.34,107.82 49.09,107.57 27.11,107.57
RTC_RST  (via drill 0.3)
  Top 0.127: v23.62,61.98 22.73,61.09 22.73,60.83 U2.16 | v60.07,58.04 86.11,58.04 87,58.93 U3.4
  Bottom 0.127: v23.62,61.98 56.13,61.98 v60.07,58.04
RX
  Top 0.127: TP2.TP 12.57,67.18 12.57,60.83 U2.24
SCK  (via drill 0.3)
  Top 0.127: U1.6 49.21,47.62 47.5,45.91 23.62,45.91 23.24,46.29 13.34,46.29 12.7,45.66 12.7,44.64 12.73,44.61 | 12.73,44.61 13.78,43.56 13.78,43.37 U2.6 | v4.76,91.12 5.08,91.44 5.84,91.44 J4.P5 | v12.7,44.58 12.73,44.61 | v83.63,13.72 83.63,15.37 J1.13 | v102.68,13.72 TP8.TP | v46.99,3.11 46.99,3.17 46.35,3.81 R6.1 | D10.2 v12.19,15.24 16.57,15.24 v28.7,3.11
  Bottom 0.127: v4.76,91.12 4.76,50.61 11.37,44.01 12.13,44.01 12.16,44.04 | v12.7,44.58 12.16,44.04 | v102.68,13.72 91.89,13.72 | 91.89,13.72 v83.63,13.72 | 91.89,13.72 91.89,13.08 91.63,12.83 77.09,12.83 67.37,3.11 v46.99,3.11 v28.7,3.11 | v12.19,15.24 12.19,44.01 12.16,44.04
SCL  (via drill 0.3)
  Top 0.127: R2-PINH.1 143.51,19.49 v144.34,20.32 | v145.73,23.43 145.73,24.07 145.92,24.26 SENSOR2.4 | v152.72,20.83 164.4,20.83 J3.4 | v39.56,62.42 40.93,63.79 | 40.93,63.79 40.96,63.82 40.96,64.71 40.7,64.96 40.39,64.96 U4.7 | v20,62.42 18.99,62.42 17.65,61.09 17.65,60.83 U2.20 | U3.16 90.81,50.48 v89.98,51.31 | v56.39,63.75 40.96,63.75 40.93,63.79 | v92.39,48.9 v99.12,42.16
  Bottom 0.127: v144.34,20.32 144.34,22.04 144.37,22.07 | 144.37,22.07 v145.73,23.43 148.34,20.83 v152.72,20.83 | v20,62.42 v39.56,62.42 | v56.39,63.75 68.83,51.31 v89.98,51.31 v92.39,48.9 | v99.12,42.16 123.76,42.16 143.83,22.1 144.34,22.1 144.37,22.07
SDA  (via drill 0.3)
  Top 0.127: v148.02,17.78 147.96,17.78 147.32,17.14 R1_PINH.1 | v148.02,20.51 145.22,23.3 145.22,24.26 SENSOR2.3 | v153.73,19.81 164.4,19.81 J3.3 | v39.12,65.79 39.75,65.79 40.01,65.53 40.32,65.53 U4.8 | v30.42,65.79 24.45,59.82 19.62,59.82 18.92,60.52 18.92,60.77 U2.19 | v89.34,51.75 89.53,51.56 U3.15 89.53,49.91 90.17,49.28 v90.17,48.01
  Bottom 0.127: v148.02,20.51 148.02,19.88 | 148.02,19.88 148.02,19.81 | 148.02,19.81 v148.02,17.78 | 148.02,19.81 v153.73,19.81 | v30.42,65.79 v39.12,65.79 41.27,67.94 52.83,67.94 69.03,51.75 v89.34,51.75 | 148.02,19.88 144.15,19.88 135.76,28.26 135.76,29.78 123.83,41.72 96.46,41.72 v90.17,48.01
SRC  (via drill 0.3)
  Top 0.127: 59.69,19.68 59.5,19.68 58.8,18.99 56.01,18.99 55.88,18.86 Q3.3 | L1.1 88.87,36.61 | 88.87,36.61 87.19,38.29 87.19,40.64 D5.2 | 59.69,19.68 73.85,19.68 74.42,19.11 75.44,19.11 76.39,20.07 76.39,24.13 v80.96,28.7 | 88.87,36.61 v84.64,32.38 | 59.69,19.68 C4.2
  Bottom 0.127: v84.64,32.38 v80.96,28.7
SS_SD  (via drill 0.3)
  Top 0.127: R10.1 56.71,3.81 57.4,3.11 58.23,3.11 58.36,3.24 58.36,4.38 57.98,4.76 52.58,4.76 52.01,4.19 52.01,3.3 51.82,3.11 49.47,3.11 44.9,7.68 24.89,7.68 20.57,12 20.57,17.53 21.27,18.22 | 21.27,18.22 21.53,18.48 22.86,18.48 23.56,17.78 D8.2 | 21.27,18.22 11.3,28.19 11.3,43.31 U2.4 11.3,43.37 11.56,43.62 v11.56,44.45 | v11.56,82.93 6.35,88.14 J4.P2
  Bottom 0.127: v11.56,44.45 v11.56,82.93
TX
  Top 0.127: TP1.TP 11.3,73.53 11.3,60.83 U2.25
USB_D+  (via drill 0.3)
  Top 0.127: v150.56,56.13 152.4,54.29 D1.4 | v71.69,48.45 54.48,48.45 52.83,46.8 48.77,46.8 45.34,43.37 24,43.37 U2.14
  Bottom 0.127: v150.56,56.13 100.27,56.13 92.58,48.45 v71.69,48.45
USB_D-  (via drill 0.3)
  Top 0.127: v147.45,56.58 146.62,55.75 146.62,52.26 146.75,52.13 147.89,52.13 148.15,52.39 152.4,52.39 D1.6 | v22.8,45.85 23.3,45.85 23.62,45.53 23.62,44.51 22.73,43.62 22.73,43.37 U2.13
  Bottom 0.127: v147.45,56.58 98.36,56.58 86.74,68.2 32,68.2 31.5,67.69 28.19,67.69 26.61,69.28 26.23,69.28 16.38,59.44 16.38,52.26 v22.8,45.85
VBAT
  Top 0.127: C2_BAT.1 135.89,42.99 142.24,49.34 Q1.3 142.24,52.01 142.27,52.04 | TP3.TP 151.19,60.96 142.27,52.04 | U4.3 38.42,64.58 38.42,64.96 U4.2 38.35,65.02 38.1,65.02 37.78,65.34 37.78,65.72 38.29,66.23 113.79,66.23 125.32,54.7 | 125.32,54.7 128.65,51.37 128.65,44.39 126.75,42.48 126.75,41.78 125.98,41.02 125.73,41.02 MCP73831.3 | 125.32,54.7 128.71,58.1 132.91,58.1 138.94,52.07 142.24,52.07 142.27,52.04
VBUS  (via drill 0.3)
  Top 0.127: 124.36,41.12 125.03,40.45 127.76,40.45 128.27,40.96 MCP73831.4 | 124.36,41.12 124.33,41.15 123.19,41.15 CHG_LED.A | 124.68,48.67 125.09,48.26 R1_PWRUSB.2 125.03,48.26 124.4,47.62 124.4,41.15 124.36,41.12 | 124.68,48.67 122.56,50.8 C1_BAT.1 | 124.68,48.67 125.48,49.47 125.79,49.47 127.13,50.8 D2.2 128.08,50.8 128.08,50.1 v128.21,49.97 | 149.86,43.81 145.48,43.81 142.05,47.24 141.35,47.24 Q1.1 141.29,47.24 141.03,46.99 v140.53,46.99 | 153.99,47.56 153.61,47.56 149.86,43.81 | 153.99,47.56 154.94,47.56 C4_USB.1 | 149.86,43.81 C5_USB.1 149.86,43.75 151.38,42.23 151.38,38.1 PFMF.050.1.2 | 153.99,47.56 153.99,52.64 154.69,53.34 D1.2 154.62,53.34 154.11,53.85 154.11,60.96 152.4,62.67 TP14.TP
  Bottom 0.127: v128.21,49.97 131.89,49.97 133.16,48.7 138.81,48.7 v140.53,46.99
VRTC  (via drill 0.3)
  Top 0.127: C10_SUPERCAP.2 97.79,49.72 95.25,52.26 C8.1 95.25,59.05 v93.15,59.05 | 90.81,62.23 R_CAPACITOR.1 | D7.1 89.15,64.77 89.15,62.55 89.47,62.23 R_CAPACITOR.1 | U3.14 88.27,57.34 89.03,58.1 89.03,61.85 89.41,62.23 R_CAPACITOR.1 | 90.81,62.23 v90.81,61.4 | 90.81,62.23 R_CAPACITOR.2
  Bottom 0.127: v90.81,61.4 v93.15,59.05
VUSB
  Top 0.127: J2.A9 163.64,56.83 163.64,56.58 J2.B4 163.7,56.58 164.08,56.58 164.66,56.01 164.66,52.58 164.08,52.01 163.7,52.01 J2.B9 163.64,52.01 163.64,51.75 J2.A4 163.58,51.69 163,51.69 155.96,44.64 155.96,38.1 PFMF.050.1.1